# Altium schematic sheet LED显示灯板_V1.0.SchDoc
size A2
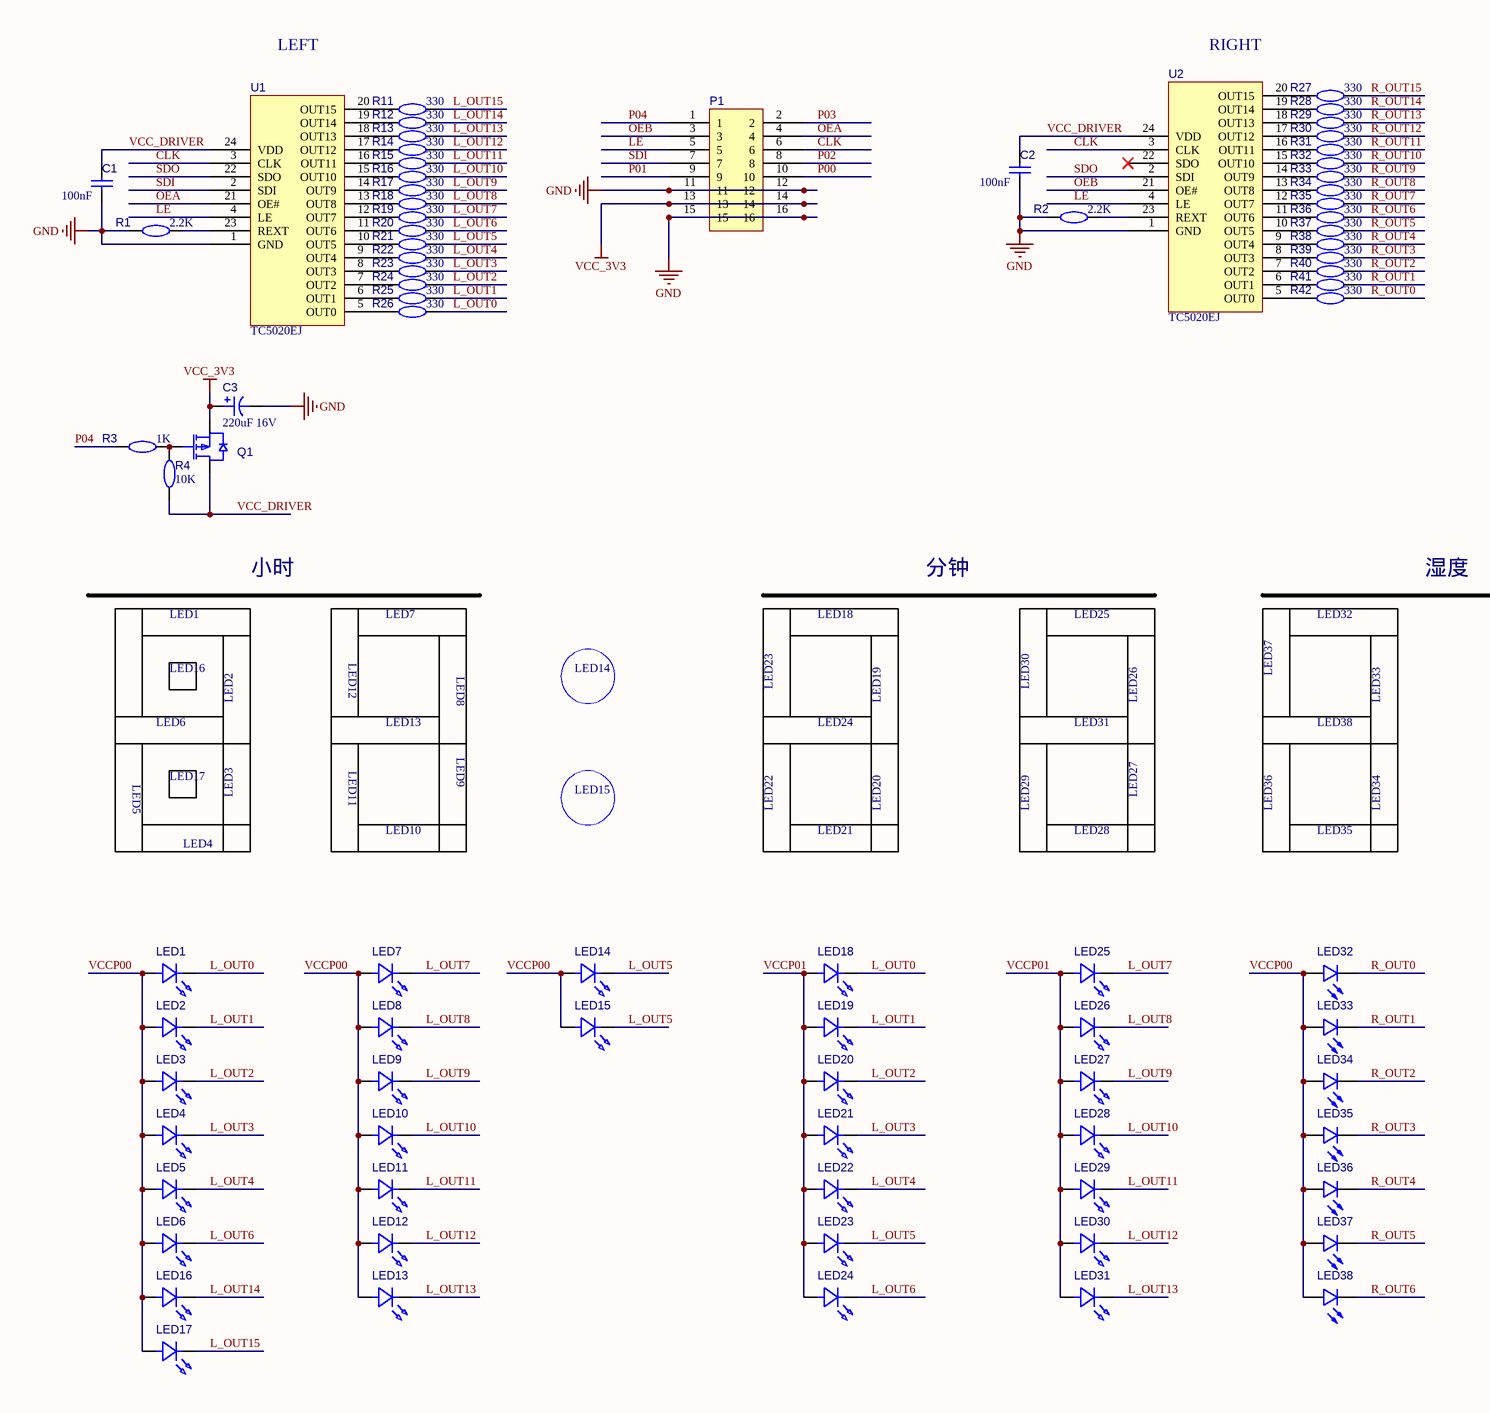
[diagram p0: LED显示灯板_V1.0.SchDoc, left]
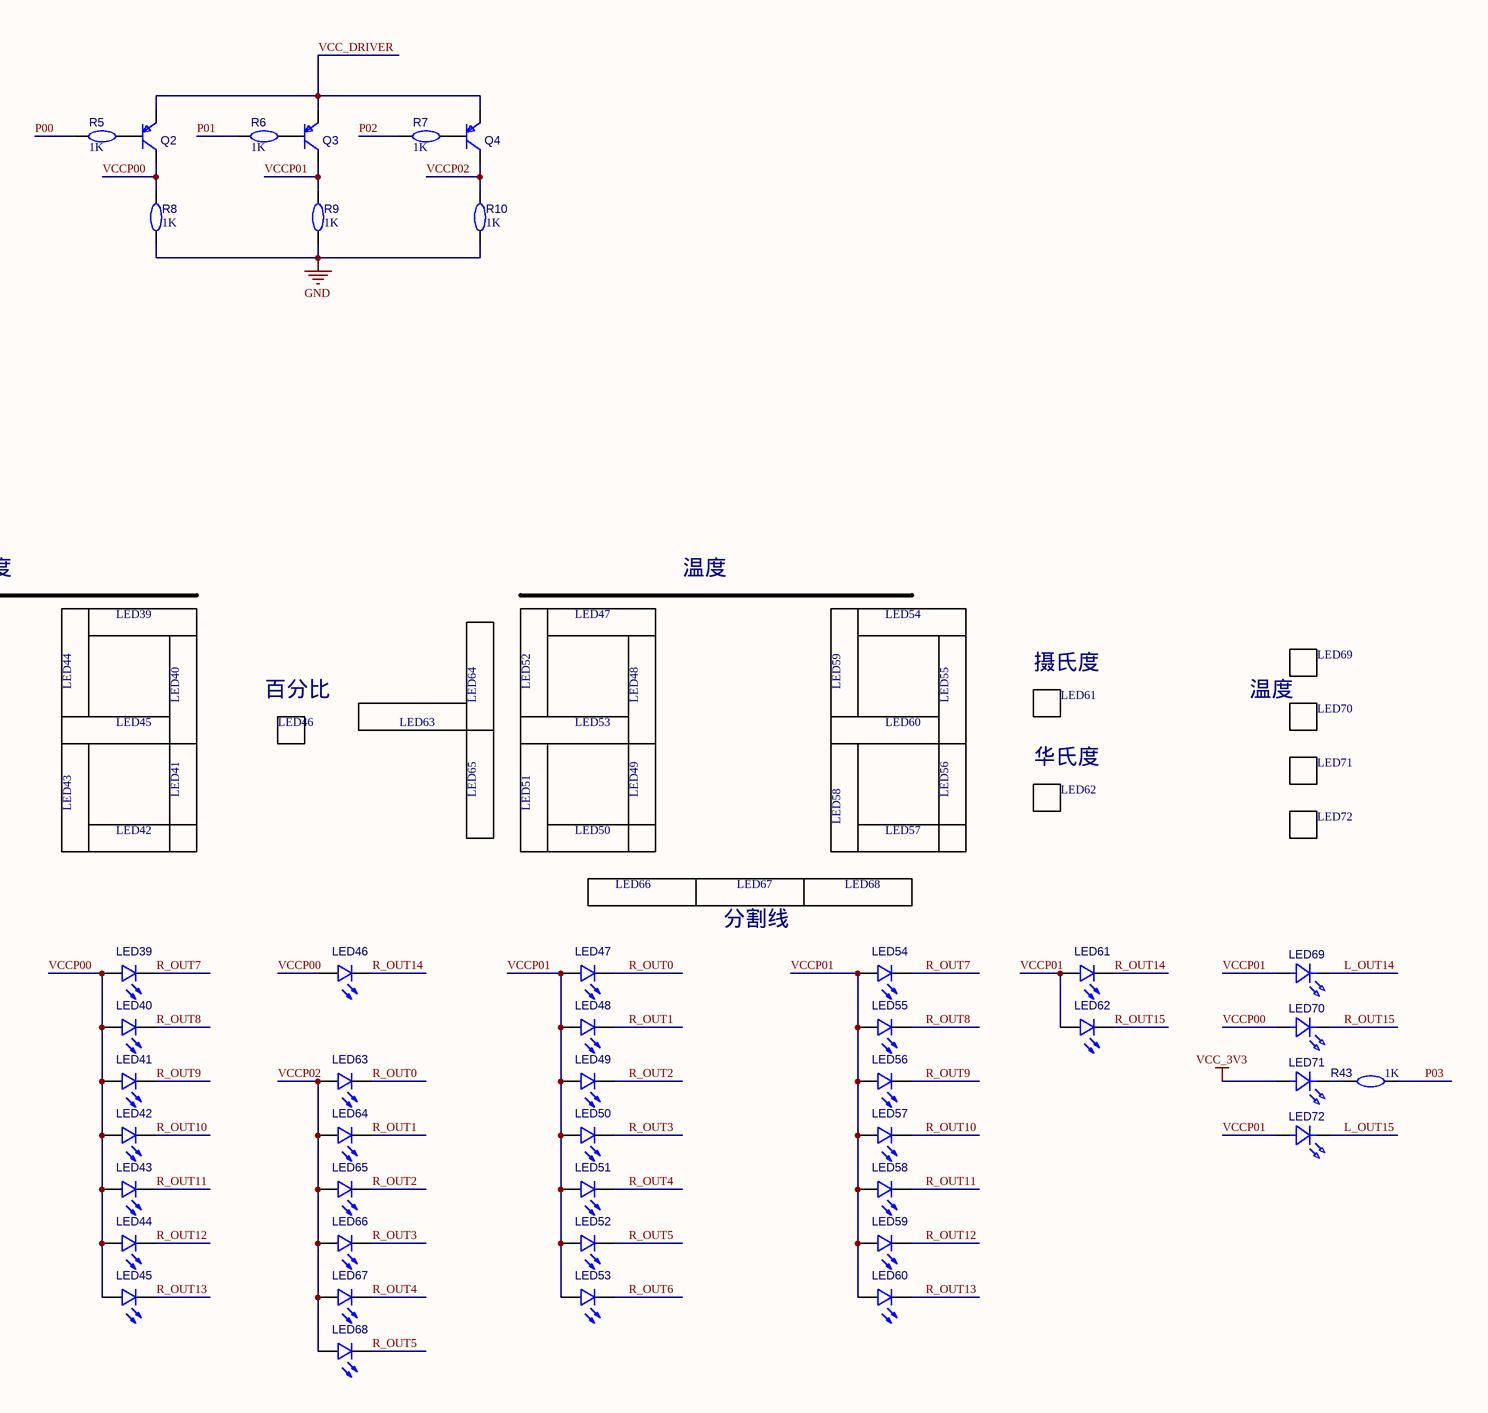
[diagram p1: LED显示灯板_V1.0.SchDoc, right]

## Parts
C1  100nF  [C0603]
C2  100nF  [C0603]
C3  220uF 16V  [CAP-SMD_BD6.3-L6.6-W6.6-FD-1]
LED1  LED_WHITE_20MA_TBD  [LED0603]  (value not drawn)
LED2  LED_WHITE_20MA_TBD  [LED0603]  (value not drawn)
LED3  LED_WHITE_20MA_TBD  [LED0603]  (value not drawn)
LED4  LED_WHITE_20MA_TBD  [LED0603]  (value not drawn)
LED5  LED_WHITE_20MA_TBD  [LED0603]  (value not drawn)
LED6  LED_WHITE_20MA_TBD  [LED0603]  (value not drawn)
LED7  LED_WHITE_20MA_TBD  [LED0603]  (value not drawn)
LED8  LED_WHITE_20MA_TBD  [LED0603]  (value not drawn)
LED9  LED_WHITE_20MA_TBD  [LED0603]  (value not drawn)
LED10  LED_WHITE_20MA_TBD  [LED0603]  (value not drawn)
LED11  LED_WHITE_20MA_TBD  [LED0603]  (value not drawn)
LED12  LED_WHITE_20MA_TBD  [LED0603]  (value not drawn)
LED13  LED_WHITE_20MA_TBD  [LED0603]  (value not drawn)
LED14  LED_WHITE_20MA_TBD  [LED0603]  (value not drawn)
LED15  LED_WHITE_20MA_TBD  [LED0603]  (value not drawn)
LED16  LED_WHITE_20MA_TBD  [LED0603]  (value not drawn)
LED17  LED_WHITE_20MA_TBD  [LED0603]  (value not drawn)
LED18  LED_WHITE_20MA_TBD  [LED0603]  (value not drawn)
LED19  LED_WHITE_20MA_TBD  [LED0603]  (value not drawn)
LED20  LED_WHITE_20MA_TBD  [LED0603]  (value not drawn)
LED21  LED_WHITE_20MA_TBD  [LED0603]  (value not drawn)
LED22  LED_WHITE_20MA_TBD  [LED0603]  (value not drawn)
LED23  LED_WHITE_20MA_TBD  [LED0603]  (value not drawn)
LED24  LED_WHITE_20MA_TBD  [LED0603]  (value not drawn)
LED25  LED_WHITE_20MA_TBD  [LED0603]  (value not drawn)
LED26  LED_WHITE_20MA_TBD  [LED0603]  (value not drawn)
LED27  LED_WHITE_20MA_TBD  [LED0603]  (value not drawn)
LED28  LED_WHITE_20MA_TBD  [LED0603]  (value not drawn)
LED29  LED_WHITE_20MA_TBD  [LED0603]  (value not drawn)
LED30  LED_WHITE_20MA_TBD  [LED0603]  (value not drawn)
LED31  LED_WHITE_20MA_TBD  [LED0603]  (value not drawn)
LED32  LED BLUE  [LED0603]  (value not drawn)
LED33  LED BLUE  [LED0603]  (value not drawn)
LED34  LED BLUE  [LED0603]  (value not drawn)
LED35  LED BLUE  [LED0603]  (value not drawn)
LED36  LED BLUE  [LED0603]  (value not drawn)
LED37  LED BLUE  [LED0603]  (value not drawn)
LED38  LED BLUE  [LED0603]  (value not drawn)
LED39  LED BLUE  [LED0603]  (value not drawn)
LED40  LED BLUE  [LED0603]  (value not drawn)
LED41  LED BLUE  [LED0603]  (value not drawn)
LED42  LED BLUE  [LED0603]  (value not drawn)
LED43  LED BLUE  [LED0603]  (value not drawn)
LED44  LED BLUE  [LED0603]  (value not drawn)
LED45  LED BLUE  [LED0603]  (value not drawn)
LED46  LED BLUE  [LED0603]  (value not drawn)
LED47  LED BLUE  [LED0603]  (value not drawn)
LED48  LED BLUE  [LED0603]  (value not drawn)
LED49  LED BLUE  [LED0603]  (value not drawn)
LED50  LED BLUE  [LED0603]  (value not drawn)
LED51  LED BLUE  [LED0603]  (value not drawn)
LED52  LED BLUE  [LED0603]  (value not drawn)
LED53  LED BLUE  [LED0603]  (value not drawn)
LED54  LED BLUE  [LED0603]  (value not drawn)
LED55  LED BLUE  [LED0603]  (value not drawn)
LED56  LED BLUE  [LED0603]  (value not drawn)
LED57  LED BLUE  [LED0603]  (value not drawn)
LED58  LED BLUE  [LED0603]  (value not drawn)
LED59  LED BLUE  [LED0603]  (value not drawn)
LED60  LED BLUE  [LED0603]  (value not drawn)
LED61  LED BLUE  [LED0603]  (value not drawn)
LED62  LED BLUE  [LED0603]  (value not drawn)
LED63  LED BLUE  [LED0603]  (value not drawn)
LED64  LED BLUE  [LED0603]  (value not drawn)
LED65  LED BLUE  [LED0603]  (value not drawn)
LED66  LED BLUE  [LED0603]  (value not drawn)
LED67  LED BLUE  [LED0603]  (value not drawn)
LED68  LED BLUE  [LED0603]  (value not drawn)
LED69  LED_WHITE_20MA_TBD  [LED0603]  (value not drawn)
LED70  LED_WHITE_20MA_TBD  [LED0603]  (value not drawn)
LED71  LED_WHITE_20MA_TBD  [LED0603]  (value not drawn)
LED72  LED_WHITE_20MA_TBD  [LED0603]  (value not drawn)
P1  HEADER 2x8P 2.54mm  [IDC-TH_16P-P2.54-V-R2-C8-S2.54]  (value not drawn)
Q1  P-MOSFET 30V 4A  [SOT-23_L2.9-W1.3-P1.90-LS2.4-BR]  (value not drawn)
Q2  S8550  [SOT-23-3_L2.9-W1.3-P1.90-LS2.4-BR]  (value not drawn)
Q3  S8550  [SOT-23-3_L2.9-W1.3-P1.90-LS2.4-BR]  (value not drawn)
Q4  S8550  [SOT-23-3_L2.9-W1.3-P1.90-LS2.4-BR]  (value not drawn)
R1  2.2K  [R0603]
R2  2.2K  [R0603]
R3  1K  [R0603]
R4  10K  [R0603]
R5  1K  [R0603]
R6  1K  [R0603]
R7  1K  [R0603]
R8  1K  [R0603]
R9  1K  [R0603]
R10  1K  [R0603]
R11  330  [R0603]
R12  330  [R0603]
R13  330  [R0603]
R14  330  [R0603]
R15  330  [R0603]
R16  330  [R0603]
R17  330  [R0603]
R18  330  [R0603]
R19  330  [R0603]
R20  330  [R0603]
R21  330  [R0603]
R22  330  [R0603]
R23  330  [R0603]
R24  330  [R0603]
R25  330  [R0603]
R26  330  [R0603]
R27  330  [R0603]
R28  330  [R0603]
R29  330  [R0603]
R30  330  [R0603]
R31  330  [R0603]
R32  330  [R0603]
R33  330  [R0603]
R34  330  [R0603]
R35  330  [R0603]
R36  330  [R0603]
R37  330  [R0603]
R38  330  [R0603]
R39  330  [R0603]
R40  330  [R0603]
R41  330  [R0603]
R42  330  [R0603]
R43  1K  [R0603]
U1  TC5020EJ  [SSOP-24_L8.7-W3.9-P0.64-LS6.0-BL]
U2  TC5020EJ  [SSOP-24_L8.7-W3.9-P0.64-LS6.0-BL]

## Nets
GND: C1.1 C2.1 C3.2 P1.11 P1.12 P1.15 P1.16 R1.1 R2.1 R8.2 R9.2 R10.2 U1.1(GND) U2.1(GND)
VCC_3V3: C3.1 LED71.2(A) P1.13 P1.14 Q1.2(S)
CLK: P1.6 U1.3(CLK) U2.3(CLK)
L_OUT0: LED1.1(K) LED18.1(K) R26.2
L_OUT1: LED2.1(K) LED19.1(K) R25.2
L_OUT2: LED3.1(K) LED20.1(K) R24.2
L_OUT3: LED4.1(K) LED21.1(K) R23.2
L_OUT4: LED5.1(K) LED22.1(K) R22.2
L_OUT5: LED14.1(K) LED15.1(K) LED23.1(K) R21.2
L_OUT6: LED6.1(K) LED24.1(K) R20.2
L_OUT7: LED7.1(K) LED25.1(K) R19.2
L_OUT8: LED8.1(K) LED26.1(K) R18.2
L_OUT9: LED9.1(K) LED27.1(K) R17.2
L_OUT10: LED10.1(K) LED28.1(K) R16.2
L_OUT11: LED11.1(K) LED29.1(K) R15.2
L_OUT12: LED12.1(K) LED30.1(K) R14.2
L_OUT13: LED13.1(K) LED31.1(K) R13.2
L_OUT14: LED16.1(K) LED69.1(K) R12.2
L_OUT15: LED17.1(K) LED72.1(K) R11.2
LE: P1.5 U1.4(LE) U2.4(LE)
OEA: P1.4 U1.21(OE#)
OEB: P1.3 U2.21(OE#)
P00: P1.10 R5.2
P01: P1.9 R6.2
P02: P1.8 R7.2
P03: P1.2 R43.2
P04: P1.1 R3.1
R_OUT0: LED32.1(-) LED47.1(-) LED63.1(-) R42.2
R_OUT1: LED33.1(-) LED48.1(-) LED64.1(-) R41.2
R_OUT2: LED34.1(-) LED49.1(-) LED65.1(-) R40.2
R_OUT3: LED35.1(-) LED50.1(-) LED66.1(-) R39.2
R_OUT4: LED36.1(-) LED51.1(-) LED67.1(-) R38.2
R_OUT5: LED37.1(-) LED52.1(-) LED68.1(-) R37.2
R_OUT6: LED38.1(-) LED53.1(-) R36.2
R_OUT7: LED39.1(-) LED54.1(-) R35.2
R_OUT8: LED40.1(-) LED55.1(-) R34.2
R_OUT9: LED41.1(-) LED56.1(-) R33.2
R_OUT10: LED42.1(-) LED57.1(-) R32.2
R_OUT11: LED43.1(-) LED58.1(-) R31.2
R_OUT12: LED44.1(-) LED59.1(-) R30.2
R_OUT13: LED45.1(-) LED60.1(-) R29.2
R_OUT14: LED46.1(-) LED61.1(-) R28.2
R_OUT15: LED62.1(-) LED70.1(K) R27.2
SDI: P1.7 U1.2(SDI)
SDO: U1.22(SDO) U2.2(SDI)
VCC_DRIVER: C1.2 C2.2 Q1.3(D) Q2.2(E) Q3.2(E) Q4.2(E) R4.1 U1.24(VDD) U2.24(VDD)
VCCP00: LED1.2(A) LED2.2(A) LED3.2(A) LED4.2(A) LED5.2(A) LED6.2(A) LED7.2(A) LED8.2(A) LED9.2(A) LED10.2(A) LED11.2(A) LED12.2(A) LED13.2(A) LED14.2(A) LED15.2(A) LED16.2(A) LED17.2(A) LED32.2(+) LED33.2(+) LED34.2(+) LED35.2(+) LED36.2(+) LED37.2(+) LED38.2(+) LED39.2(+) LED40.2(+) LED41.2(+) LED42.2(+) LED43.2(+) LED44.2(+) LED45.2(+) LED46.2(+) LED70.2(A) Q2.3(C) R8.1
VCCP01: LED18.2(A) LED19.2(A) LED20.2(A) LED21.2(A) LED22.2(A) LED23.2(A) LED24.2(A) LED25.2(A) LED26.2(A) LED27.2(A) LED28.2(A) LED29.2(A) LED30.2(A) LED31.2(A) LED47.2(+) LED48.2(+) LED49.2(+) LED50.2(+) LED51.2(+) LED52.2(+) LED53.2(+) LED54.2(+) LED55.2(+) LED56.2(+) LED57.2(+) LED58.2(+) LED59.2(+) LED60.2(+) LED61.2(+) LED62.2(+) LED69.2(A) LED72.2(A) Q3.3(C) R9.1
VCCP02: LED63.2(+) LED64.2(+) LED65.2(+) LED66.2(+) LED67.2(+) LED68.2(+) Q4.3(C) R10.1
NetLED71_1: LED71.1(K) R43.1
NetQ1_1: Q1.1(G) R3.2 R4.2
NetQ2_1: Q2.1(B) R5.1
NetQ3_1: Q3.1(B) R6.1
NetQ4_1: Q4.1(B) R7.1
NetR1_2: R1.2 U1.23(REXT)
NetR2_2: R2.2 U2.23(REXT)
NetR11_1: R11.1 U1.20(OUT15)
NetR12_1: R12.1 U1.19(OUT14)
NetR13_1: R13.1 U1.18(OUT13)
NetR14_1: R14.1 U1.17(OUT12)
NetR15_1: R15.1 U1.16(OUT11)
NetR16_1: R16.1 U1.15(OUT10)
NetR17_1: R17.1 U1.14(OUT9)
NetR18_1: R18.1 U1.13(OUT8)
NetR19_1: R19.1 U1.12(OUT7)
NetR20_1: R20.1 U1.11(OUT6)
NetR21_1: R21.1 U1.10(OUT5)
NetR22_1: R22.1 U1.9(OUT4)
NetR23_1: R23.1 U1.8(OUT3)
NetR24_1: R24.1 U1.7(OUT2)
NetR25_1: R25.1 U1.6(OUT1)
NetR26_1: R26.1 U1.5(OUT0)
NetR27_1: R27.1 U2.20(OUT15)
NetR28_1: R28.1 U2.19(OUT14)
NetR29_1: R29.1 U2.18(OUT13)
NetR30_1: R30.1 U2.17(OUT12)
NetR31_1: R31.1 U2.16(OUT11)
NetR32_1: R32.1 U2.15(OUT10)
NetR33_1: R33.1 U2.14(OUT9)
NetR34_1: R34.1 U2.13(OUT8)
NetR35_1: R35.1 U2.12(OUT7)
NetR36_1: R36.1 U2.11(OUT6)
NetR37_1: R37.1 U2.10(OUT5)
NetR38_1: R38.1 U2.9(OUT4)
NetR39_1: R39.1 U2.8(OUT3)
NetR40_1: R40.1 U2.7(OUT2)
NetR41_1: R41.1 U2.6(OUT1)
NetR42_1: R42.1 U2.5(OUT0)

Not connected (* = marked no-connect by the designer): U2 22(SDO)*

## Notes on the sheet
- LEFT
- (near U2) RIGHT
- LED1
- 小时
- LED7
- LED18
- 分钟
- LED25
- LED32
- 湿度
- LED39
- LED47
- 温度
- LED54
- LED16
- LED12
- LED8
- LED14
- LED23
- LED30
- LED37
- LED44
- LED52
- LED59
- 摄氏度
- LED69
- LED6
- LED2
- LED13
- LED9
- LED24
- LED19
- LED31
- LED26
- LED38
- LED33
- LED45
- LED40
- 百分比
- LED46
- LED63
- LED64
- LED53
- LED48
- LED60
- LED55
- LED61
- LED70
- LED5
- LED17
- LED3
- LED11
- LED15
- LED22
- LED20
- LED29
- LED27
- LED36
- LED34
- LED43
- LED41
- LED65
- LED51
- LED49
- LED58
- LED56
- 华氏度
- LED62
- LED71
- LED72
- LED4
- LED10
- LED21
- LED28
- LED35
- LED42
- LED50
- LED66
- LED67
- LED68
- LED57
- 分割线

## Library data of the parts
C1 C2 = CAP_C0603_50V_10nF 50V: 贴片电容; Symbol: CC0603KRX7R9BB103
C3 = CAP_ELEC_SMD_220U_16V: 贴片型铝电解电容; Symbol: JVJ16V220M6X8
LED1-LED31 LED69-LED72 = LED_WHITE_20MA_TBD: 发光二极管; Symbol: NCD0603W6
LED32-LED68 = LED_BLUE_10MA_TBD: 发光二极管; Symbol: FC-DA1608BK-470H10
P1 = HDR_2x08_2.54mm_IDC: 简牛座; Symbol: BH254V-16P
Q1 = AO3401A: P沟道场效应管; Symbol: AO3401A
Q2-Q4 = S8550: 三极管PNP; Symbol: S8550_C20069126
R1-R43 = R_0603_100MW: 贴片电阻; Symbol: RC0603JR-071ML
U1 U2 = TC5020EJ: LED 驱动芯片; C: C22436638; Symbol: TC5020EJ